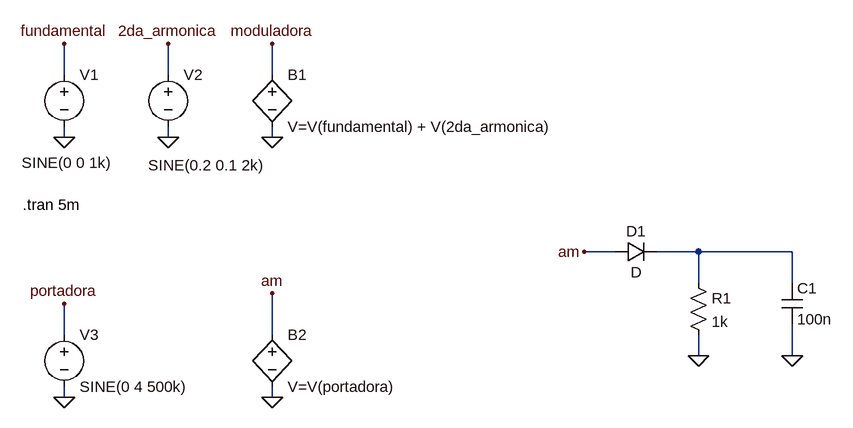
[diagram p0: schematic AM_mod.asc]
AM_mod.asc, the LTspice schematic file:
Version 4
SHEET 1 1256 680
WIRE 64 96 64 48
WIRE 224 96 224 48
WIRE 384 96 384 48
WIRE 64 192 64 176
WIRE 224 192 224 176
WIRE 384 192 384 176
WIRE 912 368 864 368
WIRE 1040 368 976 368
WIRE 1184 368 1040 368
WIRE 1040 416 1040 368
WIRE 1184 416 1184 368
WIRE 64 496 64 448
WIRE 384 496 384 432
WIRE 1040 528 1040 496
WIRE 1184 528 1184 480
WIRE 64 592 64 576
WIRE 384 592 384 576
FLAG 384 192 0
FLAG 224 192 0
FLAG 64 192 0
FLAG 64 48 fundamental
FLAG 224 48 2da_armonica
FLAG 384 48 moduladora
FLAG 64 592 0
FLAG 64 448 portadora
FLAG 384 592 0
FLAG 384 432 am
FLAG 1040 528 0
FLAG 1184 528 0
FLAG 864 368 am
SYMBOL voltage 64 80 R0
WINDOW 3 -65 151 Left 2
WINDOW 123 0 0 Left 2
WINDOW 39 0 0 Left 2
SYMATTR Value SINE(0 0 1k)
SYMATTR InstName V1
SYMBOL voltage 224 80 R0
WINDOW 3 -31 155 Left 2
WINDOW 123 0 0 Left 2
WINDOW 39 0 0 Left 2
SYMATTR Value SINE(0.2 0.1 2k)
SYMATTR InstName V2
SYMBOL bv 384 80 R0
SYMATTR InstName B1
SYMATTR Value V=V(fundamental) + V(2da_armonica)
SYMBOL voltage 64 480 R0
WINDOW 123 0 0 Left 2
WINDOW 39 0 0 Left 2
SYMATTR InstName V3
SYMATTR Value SINE(0 4 500k)
SYMBOL bv 384 480 R0
SYMATTR InstName B2
SYMATTR Value V=V(portadora)
SYMBOL diode 912 384 R270
WINDOW 0 32 32 VTop 2
WINDOW 3 0 32 VBottom 2
SYMATTR InstName D1
SYMBOL res 1024 400 R0
SYMATTR InstName R1
SYMATTR Value 1k
SYMBOL cap 1168 416 R0
SYMATTR InstName C1
SYMATTR Value 100n
TEXT 0 296 Left 2 !.tran 5m

The netlist it stands for:
* AM_mod.asc
V1 fundamental 0 SINE(0 0 1k)
V2 2da_armonica 0 SINE(0.2 0.1 2k)
B1 moduladora 0 V=V(fundamental) + V(2da_armonica)
V3 portadora 0 SINE(0 4 500k)
B2 am 0 V=V(portadora)
D1 am N001 D
R1 N001 0 1k
C1 N001 0 100n
.model D D
.lib standard.dio
.tran 5m
.backanno
.end